# Altium schematic sheet GSM USB Port.SchDoc: GSM USB Port
size 292 x 193 mm; SheetNumber: 36; SheetTotal: 40
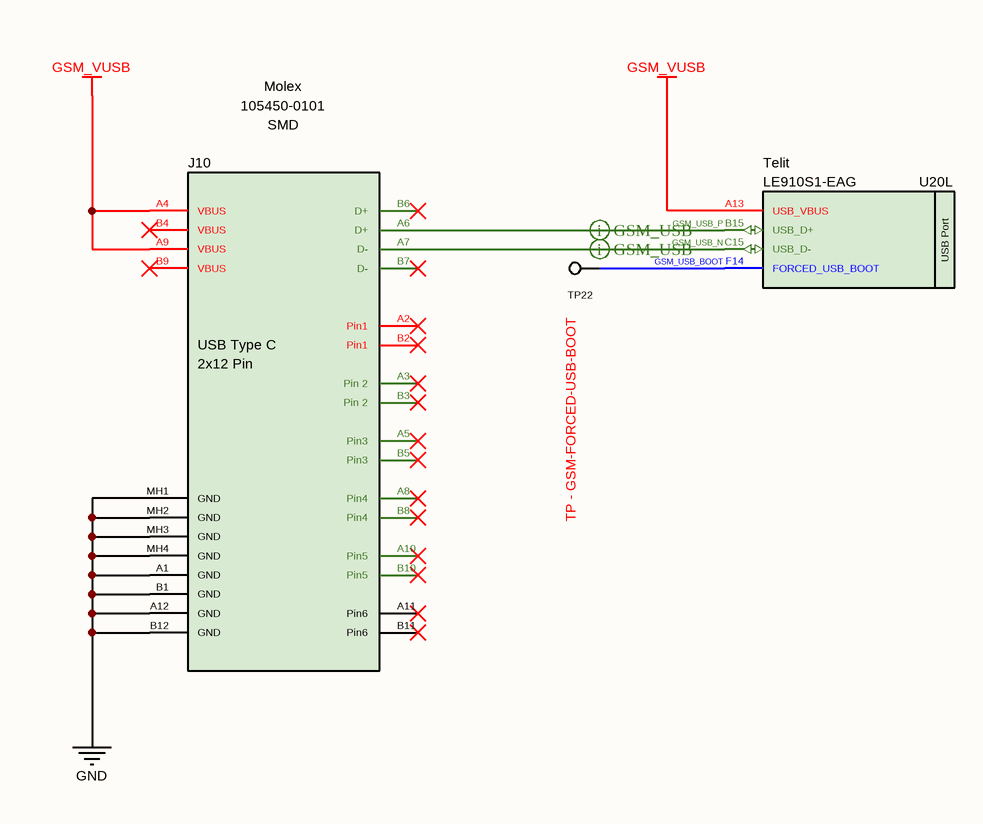
[diagram p0: GSM USB Port.SchDoc]

## Parts
J10  Manufacturer Name: Molex  Case: SMD  [USB Type C - Molex 105450-0101]  (hidden comment: 105450-0101)
TP22  TP - GSM-FORCED-USB-BOOT  [TP]  (no BOM)
U20  Manufacturer Part Number: LE910S1-EAG  Manufacturer Name: Telit  [LE910 GSM Modem]  (hidden comment: LE910S1-EAG LTE GSM Module)  (part L of 19)

## Nets
GND: J10.A1(GND) J10.A12(GND) J10.B1(GND) J10.B12(GND) J10.MH1(GND) J10.MH2(GND) J10.MH3(GND) J10.MH4(GND)
GSM_VUSB: J10.A4(VBUS) J10.A9(VBUS) U20.A13(USB_VBUS)
GSM_USB_BOOT: TP22.1 U20.F14(FORCED_USB_BOOT)
GSM_USB_N: J10.A7(D-) U20.C15(USB_D-)
GSM_USB_P: J10.A6(D+) U20.B15(USB_D+)

Not connected (* = marked no-connect by the designer): J10 A2(Pin1)* A3(Pin_2)* A5(Pin3)* A8(Pin4)* A10(Pin5)* A11(Pin6)* B2(Pin1)* B3(Pin_2)* B4(VBUS)* B5(Pin3)* B6(D+)* B7(D-)* B8(Pin4)* B9(VBUS)* B10(Pin5)* B11(Pin6)*

## Layout directives
differential pair: GSM_USB_N, GSM_USB_P

## Notes on the sheet
- © 2022 All rights reserved.
  This document may not, in whole or in part, be copied, photocopied, reproduced, translated or converted to any electronic or machine readable from without prior written permission of Mehmet Günce Akkoyun.
  Engineer contact : akkoyun@me.com
- Property of
- Engineer :
- Date :
- Size :
- A4
- Time :
- Project :
- Page :
- /
- Customer :
- Product ID :
- Module ID :
- Version :
- File :
- Revision :
- (in symbol Connector - USB Type C SMD Connector) USB Type C; 2x12 Pin
- (in symbol IC - LE910S1-EAG, part L) USB Port

## Library data of the parts
J10 = Connector - USB Type C SMD Connector: USB Shielded I/O Receptacle; Type C; Right Angle; Surface Mount; Gold over Nickel; Current Rating: 5 A.; Gender: Jack (Female); Number of Contacts: 24 Contact; Voltage Rating: 30 V; Maximum Operating Temperature: + 85 C; Minimum Operating Temperature: - 30 C; Mounting Angle: Right Angle; Product Type: USB Connectors; RoHS: Yes; Manufacturer Part Number: 105450-0101
TP22 = PCB - Test Point: Test Point
U20 = IC - LE910S1-EAG: Telit LE910S1-EAG GPRS/GNSS Module; Case: BGA